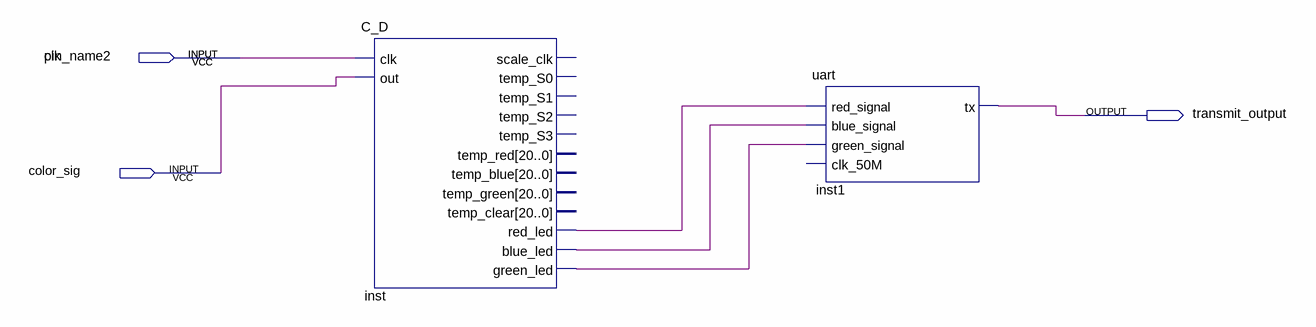
[diagram p0: schematic sheet]
// Quartus schematic color_sensor.bdf as structural Verilog: 2 symbols, 4 pins
module color_sensor (
  input  pin_name2,
  input  clk,
  input  color_sig,
  output transmit_output
);

  wire inst_blue_led, inst_green_led, inst_red_led;

  C_D inst (
    .clk(clk), .out(color_sig), .red_led(inst_red_led), .blue_led(inst_blue_led), .green_led(inst_green_led));  // open: scale_clk, temp_S0, temp_S1, temp_S2, temp_S3, temp_red, temp_blue, temp_green, temp_clear
  uart inst1 (
    .red_signal(inst_red_led), .blue_signal(inst_blue_led), .green_signal(inst_green_led),
    .tx(transmit_output));  // open: clk_50M

  assign pin_name2 = clk;
endmodule
